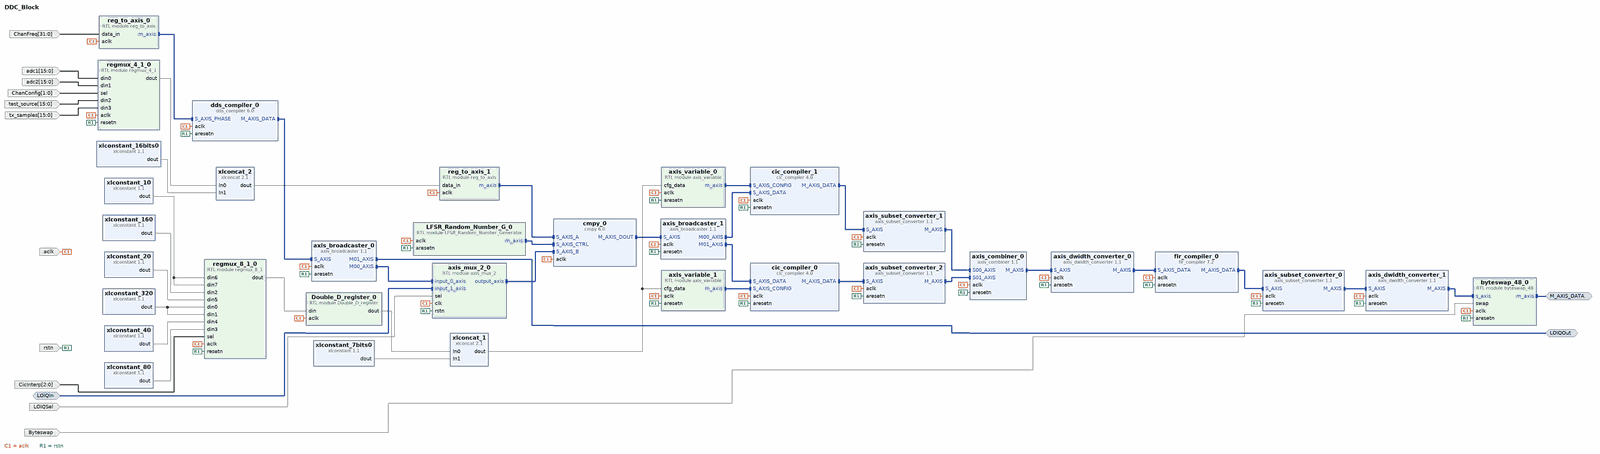
[diagram p0: block diagram of the top level, whole]
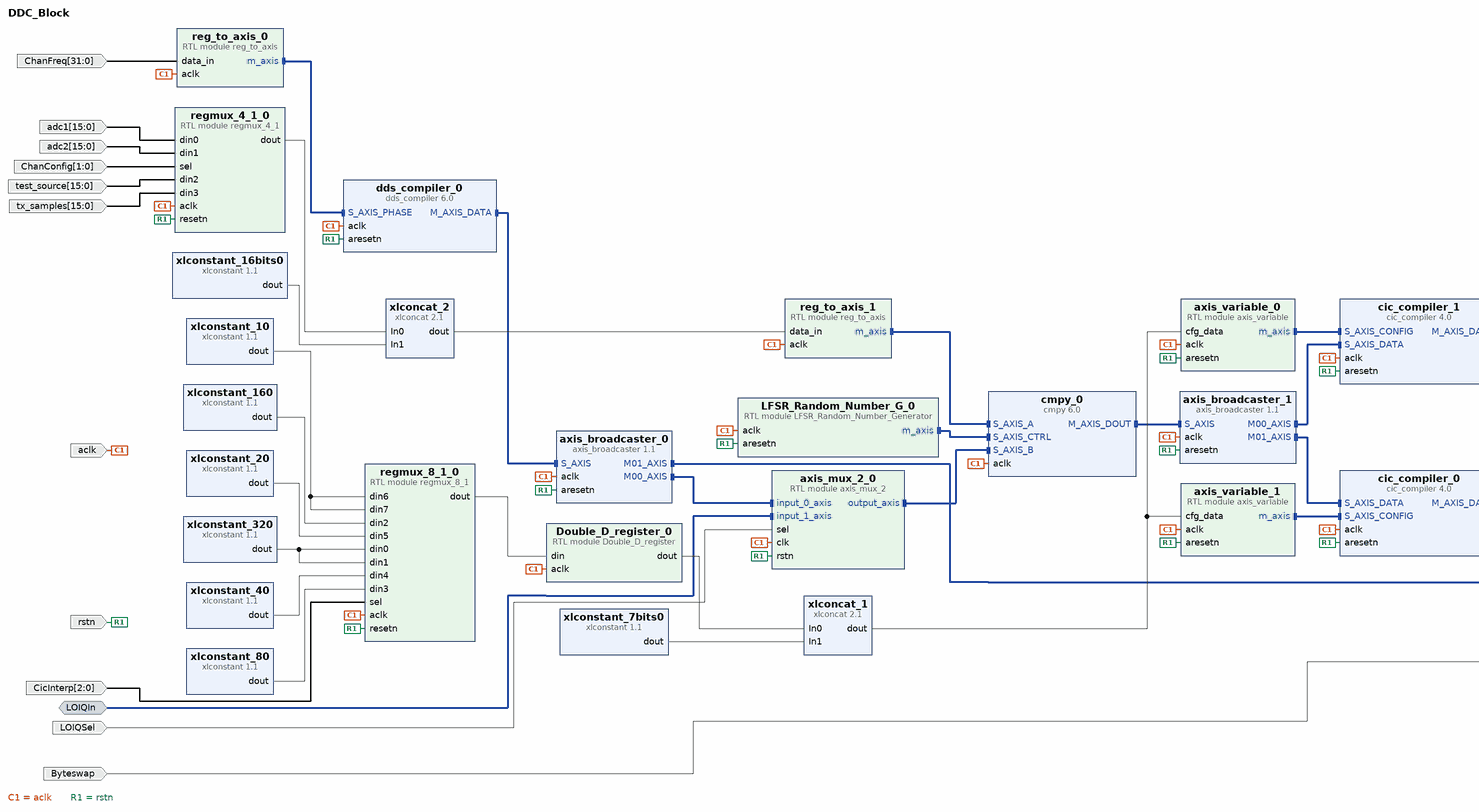
[diagram p1: block diagram of the top level, left part]
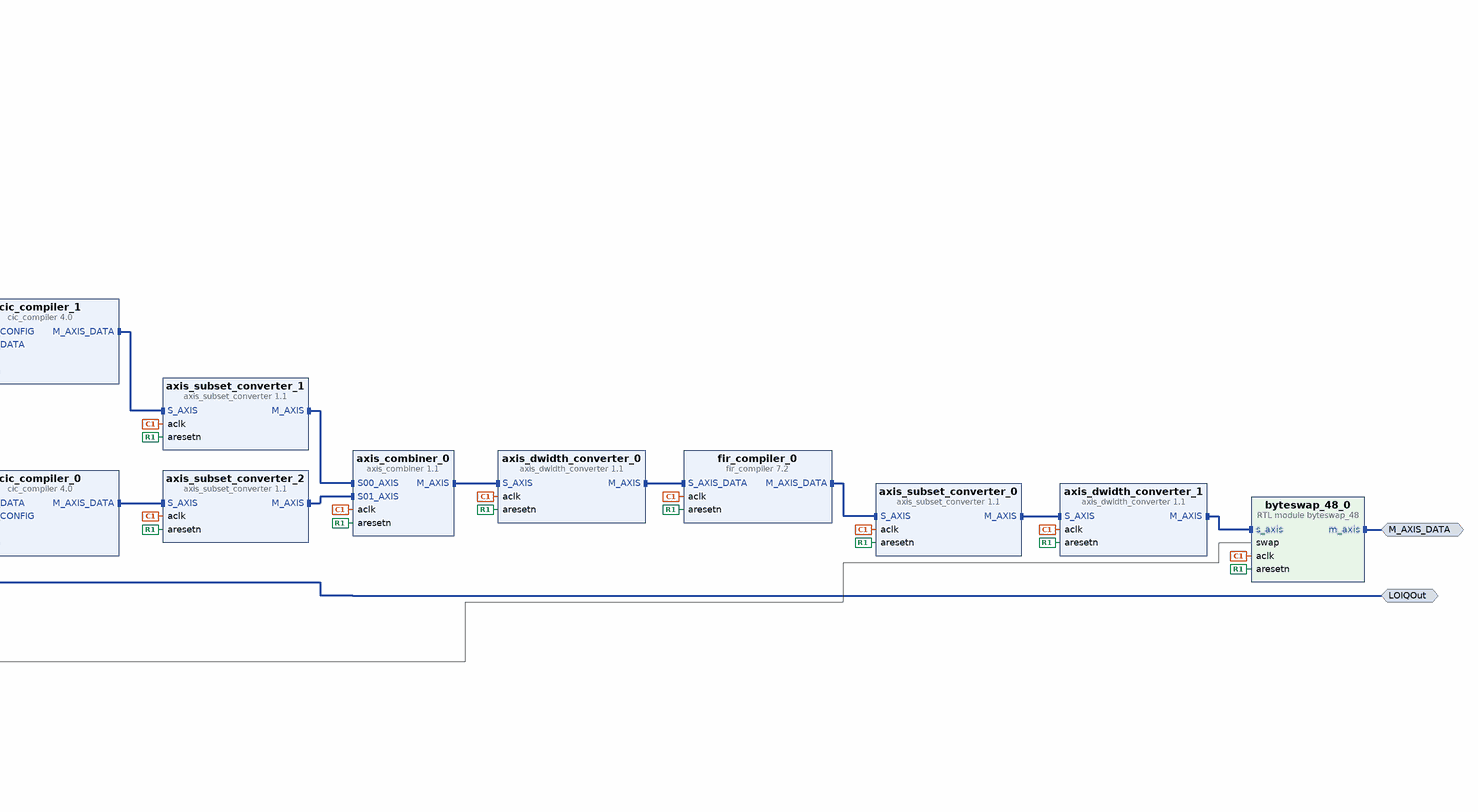
[diagram p2: block diagram of the top level, right part]
# Vivado block design DDC_Block, xc7a200tfbg676-2, Vivado 2023.1
create_bd_design DDC_Block

create_bd_intf_port -mode Master -vlnv xilinx.com:interface:axis_rtl:1.0 M_AXIS_DATA
set_property -dict {CONFIG.FREQ_HZ 122880000} [get_bd_intf_ports M_AXIS_DATA]
create_bd_intf_port -mode Master -vlnv xilinx.com:interface:axis_rtl:1.0 LOIQOut
set_property -dict {CONFIG.FREQ_HZ 122880000} [get_bd_intf_ports LOIQOut]
create_bd_intf_port -mode Slave -vlnv xilinx.com:interface:axis_rtl:1.0 LOIQIn
set_property -dict [list \
  CONFIG.FREQ_HZ 122880000 \
  CONFIG.HAS_TKEEP 0 \
  CONFIG.HAS_TLAST 0 \
  CONFIG.HAS_TREADY 1 \
  CONFIG.HAS_TSTRB 0 \
  CONFIG.LAYERED_METADATA undef \
  CONFIG.TDATA_NUM_BYTES 4 \
  CONFIG.TDEST_WIDTH 0 \
  CONFIG.TID_WIDTH 0 \
  CONFIG.TUSER_WIDTH 0 \
] [get_bd_intf_ports LOIQIn]
create_bd_port -dir I -from 1 -to 0 ChanConfig
create_bd_port -dir I -from 31 -to 0 ChanFreq
create_bd_port -dir I -from 2 -to 0 CicInterp
create_bd_port -dir I -type clk aclk
set_property -dict {CONFIG.FREQ_HZ 122880000} [get_bd_ports aclk]
create_bd_port -dir I -from 15 -to 0 adc1
create_bd_port -dir I -from 15 -to 0 adc2
create_bd_port -dir I -type rst rstn
create_bd_port -dir I -from 15 -to 0 test_source
create_bd_port -dir I -from 15 -to 0 tx_samples
create_bd_port -dir I LOIQSel
create_bd_port -dir I Byteswap

create_bd_cell -type ip -vlnv xilinx.com:ip:xlconcat:2.1 xlconcat_1
create_bd_cell -type ip -vlnv xilinx.com:ip:xlconcat:2.1 xlconcat_2
create_bd_cell -type module -reference Double_D_register Double_D_register_0
set_property -dict {CONFIG.DATA_WIDTH 9} [get_bd_cells Double_D_register_0]
create_bd_cell -type module -reference axis_variable axis_variable_0
set_property -dict {CONFIG.AXIS_TDATA_WIDTH 16} [get_bd_cells axis_variable_0]
create_bd_cell -type module -reference axis_variable axis_variable_1
set_property -dict {CONFIG.AXIS_TDATA_WIDTH 16} [get_bd_cells axis_variable_1]
create_bd_cell -type module -reference byteswap_48 byteswap_48_0
create_bd_cell -type ip -vlnv xilinx.com:ip:axis_broadcaster:1.1 axis_broadcaster_0
set_property -dict [list \
  CONFIG.M00_TDATA_REMAP {tdata[31:0]} \
  CONFIG.M01_TDATA_REMAP {tdata[31:0]} \
  CONFIG.M_TDATA_NUM_BYTES 4 \
  CONFIG.S_TDATA_NUM_BYTES 4 \
] [get_bd_cells axis_broadcaster_0]
create_bd_cell -type ip -vlnv xilinx.com:ip:axis_broadcaster:1.1 axis_broadcaster_1
set_property -dict [list \
  CONFIG.HAS_TREADY 0 \
  CONFIG.M00_TDATA_REMAP {tdata[23:0]} \
  CONFIG.M01_TDATA_REMAP {tdata[47:24]} \
  CONFIG.M_TDATA_NUM_BYTES 3 \
  CONFIG.S_TDATA_NUM_BYTES 6 \
] [get_bd_cells axis_broadcaster_1]
create_bd_cell -type ip -vlnv xilinx.com:ip:axis_combiner:1.1 axis_combiner_0
set_property -dict {CONFIG.NUM_SI 2} [get_bd_cells axis_combiner_0]
create_bd_cell -type ip -vlnv xilinx.com:ip:axis_dwidth_converter:1.1 axis_dwidth_converter_0
set_property -dict {CONFIG.M_TDATA_NUM_BYTES 4 CONFIG.S_TDATA_NUM_BYTES 8} [get_bd_cells axis_dwidth_converter_0]
create_bd_cell -type ip -vlnv xilinx.com:ip:axis_dwidth_converter:1.1 axis_dwidth_converter_1
set_property -dict [list \
  CONFIG.HAS_MI_TKEEP 0 \
  CONFIG.M_TDATA_NUM_BYTES 6 \
  CONFIG.S_TDATA_NUM_BYTES 3 \
] [get_bd_cells axis_dwidth_converter_1]
create_bd_cell -type ip -vlnv xilinx.com:ip:axis_subset_converter:1.1 axis_subset_converter_0
set_property -dict [list \
  CONFIG.M_TDATA_NUM_BYTES 3 \
  CONFIG.S_TDATA_NUM_BYTES 4 \
  CONFIG.TDATA_REMAP {tdata[23:0]} \
] [get_bd_cells axis_subset_converter_0]
create_bd_cell -type ip -vlnv xilinx.com:ip:axis_subset_converter:1.1 axis_subset_converter_1
set_property -dict [list \
  CONFIG.M_TDATA_NUM_BYTES 4 \
  CONFIG.S_TDATA_NUM_BYTES 4 \
  CONFIG.TDATA_REMAP {tdata[29],tdata[29], tdata[29], tdata[29], tdata[29], tdata[29], tdata[29], tdata[29:5]} \
] [get_bd_cells axis_subset_converter_1]
create_bd_cell -type ip -vlnv xilinx.com:ip:axis_subset_converter:1.1 axis_subset_converter_2
set_property -dict [list \
  CONFIG.M_TDATA_NUM_BYTES 4 \
  CONFIG.S_TDATA_NUM_BYTES 4 \
  CONFIG.TDATA_REMAP {tdata[29],tdata[29], tdata[29], tdata[29], tdata[29], tdata[29], tdata[29], tdata[29:5]} \
] [get_bd_cells axis_subset_converter_2]
create_bd_cell -type ip -vlnv xilinx.com:ip:cic_compiler:4.0 cic_compiler_0
set_property -dict [list \
  CONFIG.Clock_Frequency 122.88 \
  CONFIG.Filter_Type Decimation \
  CONFIG.Fixed_Or_Initial_Rate 40 \
  CONFIG.HAS_ARESETN true \
  CONFIG.Input_Data_Width 24 \
  CONFIG.Input_Sample_Frequency 122.88 \
  CONFIG.Maximum_Rate 320 \
  CONFIG.Minimum_Rate 10 \
  CONFIG.Number_Of_Stages 6 \
  CONFIG.Output_Data_Width 32 \
  CONFIG.Quantization Truncation \
  CONFIG.RateSpecification Frequency_Specification \
  CONFIG.SamplePeriod 1 \
  CONFIG.Sample_Rate_Changes Programmable \
  CONFIG.Use_Xtreme_DSP_Slice false \
] [get_bd_cells cic_compiler_0]
create_bd_cell -type ip -vlnv xilinx.com:ip:cic_compiler:4.0 cic_compiler_1
set_property -dict [list \
  CONFIG.Clock_Frequency 122.88 \
  CONFIG.Filter_Type Decimation \
  CONFIG.Fixed_Or_Initial_Rate 40 \
  CONFIG.HAS_ARESETN true \
  CONFIG.Input_Data_Width 24 \
  CONFIG.Input_Sample_Frequency 122.88 \
  CONFIG.Maximum_Rate 320 \
  CONFIG.Minimum_Rate 10 \
  CONFIG.Number_Of_Stages 6 \
  CONFIG.Output_Data_Width 32 \
  CONFIG.Quantization Truncation \
  CONFIG.RateSpecification Frequency_Specification \
  CONFIG.SamplePeriod 1 \
  CONFIG.Sample_Rate_Changes Programmable \
  CONFIG.Use_Xtreme_DSP_Slice false \
] [get_bd_cells cic_compiler_1]
create_bd_cell -type ip -vlnv xilinx.com:ip:cmpy:6.0 cmpy_0
set_property -dict [list \
  CONFIG.MinimumLatency 6 \
  CONFIG.OptimizeGoal Resources \
  CONFIG.OutputWidth 24 \
  CONFIG.RoundMode Random_Rounding \
] [get_bd_cells cmpy_0]
create_bd_cell -type ip -vlnv xilinx.com:ip:dds_compiler:6.0 dds_compiler_0
set_property -dict [list \
  CONFIG.Amplitude_Mode Full_Range \
  CONFIG.DATA_Has_TLAST Not_Required \
  CONFIG.DDS_Clock_Rate 122.88 \
  CONFIG.Frequency_Resolution 0.05 \
  CONFIG.Has_ARESETn true \
  CONFIG.Has_Phase_Out false \
  CONFIG.Latency 8 \
  CONFIG.M_DATA_Has_TUSER Not_Required \
  CONFIG.Noise_Shaping Auto \
  CONFIG.Output_Frequency1 0 \
  CONFIG.Output_Width 16 \
  CONFIG.PINC1 0 \
  CONFIG.Parameter_Entry System_Parameters \
  CONFIG.Phase_Increment Streaming \
  CONFIG.Phase_Width 32 \
  CONFIG.S_PHASE_Has_TUSER Not_Required \
  CONFIG.Spurious_Free_Dynamic_Range 95 \
] [get_bd_cells dds_compiler_0]
create_bd_cell -type ip -vlnv xilinx.com:ip:fir_compiler:7.2 fir_compiler_0
set_property -dict [list \
  CONFIG.Clock_Frequency 122.88 \
  CONFIG.CoefficientSource COE_File \
  CONFIG.CoefficientVector 6,0,-4,-3,5,6,-6,-13,7,44,64,44,7,-13,-6,6,5,-3,-4,0,6 \
  CONFIG.Coefficient_Fanout true \
  CONFIG.Coefficient_File ../../../../../../../sources/coefficientfiles/tx1024cfirImpulse.coe \
  CONFIG.Coefficient_Fractional_Bits 20 \
  CONFIG.Coefficient_Sets 1 \
  CONFIG.Coefficient_Sign Signed \
  CONFIG.Coefficient_Structure Inferred \
  CONFIG.Coefficient_Width 18 \
  CONFIG.ColumnConfig 13 \
  CONFIG.Control_Broadcast_Fanout true \
  CONFIG.Control_Column_Fanout true \
  CONFIG.Control_LUT_Pipeline true \
  CONFIG.Control_Path_Fanout true \
  CONFIG.DATA_Has_TLAST Not_Required \
  CONFIG.Data_Fractional_Bits 0 \
  CONFIG.Data_Path_Broadcast false \
  CONFIG.Data_Path_Fanout true \
  CONFIG.Data_Width 25 \
  CONFIG.Decimation_Rate 8 \
  CONFIG.Disable_Half_Band_Centre_Tap false \
  CONFIG.Filter_Architecture Systolic_Multiply_Accumulate \
  CONFIG.Filter_Type Decimation \
  CONFIG.Has_ARESETn true \
  CONFIG.Interpolation_Rate 1 \
  CONFIG.M_DATA_Has_TREADY true \
  CONFIG.M_DATA_Has_TUSER Not_Required \
  CONFIG.No_BRAM_Read_First_Mode true \
  CONFIG.No_SRL_Attributes false \
  CONFIG.Number_Channels 2 \
  CONFIG.Optimal_Column_Lengths true \
  CONFIG.Optimization_Goal Speed \
  CONFIG.Optimization_List Data_Path_Fanout,Pre-Adder_Pipeline,Coefficient_Fanout,Control_Path_Fanout,Control_Column_Fanout,Control_Broadcast_Fanout,Control_LUT_Pipeline,No_BRAM_Read_First_Mode,Optimal_Column_Lengths,Other \
  CONFIG.Optimization_Selection All \
  CONFIG.Other true \
  CONFIG.Output_Rounding_Mode Non_Symmetric_Rounding_Up \
  CONFIG.Output_Width 27 \
  CONFIG.Pre_Adder_Pipeline true \
  CONFIG.Quantization Quantize_Only \
  CONFIG.RateSpecification Frequency_Specification \
  CONFIG.S_DATA_Has_TUSER Not_Required \
  CONFIG.Sample_Frequency 12.288 \
  CONFIG.Select_Pattern All \
  CONFIG.Zero_Pack_Factor 1 \
] [get_bd_cells fir_compiler_0]
create_bd_cell -type ip -vlnv xilinx.com:ip:xlconstant:1.1 xlconstant_10
set_property -dict {CONFIG.CONST_VAL 10 CONFIG.CONST_WIDTH 9} [get_bd_cells xlconstant_10]
create_bd_cell -type ip -vlnv xilinx.com:ip:xlconstant:1.1 xlconstant_160
set_property -dict {CONFIG.CONST_VAL 160 CONFIG.CONST_WIDTH 9} [get_bd_cells xlconstant_160]
create_bd_cell -type ip -vlnv xilinx.com:ip:xlconstant:1.1 xlconstant_16bits0
set_property -dict {CONFIG.CONST_VAL 0 CONFIG.CONST_WIDTH 16} [get_bd_cells xlconstant_16bits0]
create_bd_cell -type ip -vlnv xilinx.com:ip:xlconstant:1.1 xlconstant_20
set_property -dict {CONFIG.CONST_VAL 20 CONFIG.CONST_WIDTH 9} [get_bd_cells xlconstant_20]
create_bd_cell -type ip -vlnv xilinx.com:ip:xlconstant:1.1 xlconstant_320
set_property -dict {CONFIG.CONST_VAL 320 CONFIG.CONST_WIDTH 9} [get_bd_cells xlconstant_320]
create_bd_cell -type ip -vlnv xilinx.com:ip:xlconstant:1.1 xlconstant_40
set_property -dict {CONFIG.CONST_VAL 40 CONFIG.CONST_WIDTH 9} [get_bd_cells xlconstant_40]
create_bd_cell -type ip -vlnv xilinx.com:ip:xlconstant:1.1 xlconstant_7bits0
set_property -dict {CONFIG.CONST_VAL 0 CONFIG.CONST_WIDTH 7} [get_bd_cells xlconstant_7bits0]
create_bd_cell -type ip -vlnv xilinx.com:ip:xlconstant:1.1 xlconstant_80
set_property -dict {CONFIG.CONST_VAL 80 CONFIG.CONST_WIDTH 9} [get_bd_cells xlconstant_80]
create_bd_cell -type module -reference reg_to_axis reg_to_axis_0
set_property -dict {CONFIG.DIN_WIDTH 32} [get_bd_cells reg_to_axis_0]
create_bd_cell -type module -reference reg_to_axis reg_to_axis_1
set_property -dict {CONFIG.DIN_WIDTH 32} [get_bd_cells reg_to_axis_1]
create_bd_cell -type module -reference axis_mux_2 axis_mux_2_0
set_property -dict [list \
  CONFIG.CONSUME_ALL 1 \
  CONFIG.DATA_WIDTH 32 \
  CONFIG.DEST_WIDTH 0 \
  CONFIG.KEEP_ENABLE false \
] [get_bd_cells axis_mux_2_0]
create_bd_cell -type module -reference LFSR_Random_Number_Generator LFSR_Random_Number_G_0
create_bd_cell -type module -reference regmux_4_1 regmux_4_1_0
create_bd_cell -type module -reference regmux_8_1 regmux_8_1_0
set_property -dict {CONFIG.DATA_WIDTH 9} [get_bd_cells regmux_8_1_0]

# ---- connections ----

connect_bd_intf_net [get_bd_intf_pins LFSR_Random_Number_G_0/m_axis] [get_bd_intf_pins cmpy_0/S_AXIS_CTRL]
connect_bd_intf_net [get_bd_intf_ports LOIQIn] [get_bd_intf_pins axis_mux_2_0/input_1_axis]
connect_bd_intf_net [get_bd_intf_pins axis_broadcaster_0/M00_AXIS] [get_bd_intf_pins axis_mux_2_0/input_0_axis]
connect_bd_intf_net [get_bd_intf_ports LOIQOut] [get_bd_intf_pins axis_broadcaster_0/M01_AXIS]
connect_bd_intf_net [get_bd_intf_pins axis_broadcaster_1/M00_AXIS] [get_bd_intf_pins cic_compiler_1/S_AXIS_DATA]
connect_bd_intf_net [get_bd_intf_pins axis_broadcaster_1/M01_AXIS] [get_bd_intf_pins cic_compiler_0/S_AXIS_DATA]
connect_bd_intf_net [get_bd_intf_pins axis_combiner_0/M_AXIS] [get_bd_intf_pins axis_dwidth_converter_0/S_AXIS]
connect_bd_intf_net [get_bd_intf_pins axis_dwidth_converter_0/M_AXIS] [get_bd_intf_pins fir_compiler_0/S_AXIS_DATA]
connect_bd_intf_net [get_bd_intf_pins axis_dwidth_converter_1/M_AXIS] [get_bd_intf_pins byteswap_48_0/s_axis]
connect_bd_intf_net [get_bd_intf_pins axis_mux_2_0/output_axis] [get_bd_intf_pins cmpy_0/S_AXIS_B]
connect_bd_intf_net [get_bd_intf_pins axis_subset_converter_0/M_AXIS] [get_bd_intf_pins axis_dwidth_converter_1/S_AXIS]
connect_bd_intf_net [get_bd_intf_pins axis_subset_converter_1/M_AXIS] [get_bd_intf_pins axis_combiner_0/S00_AXIS]
connect_bd_intf_net [get_bd_intf_pins axis_subset_converter_2/M_AXIS] [get_bd_intf_pins axis_combiner_0/S01_AXIS]
connect_bd_intf_net [get_bd_intf_pins axis_variable_0/m_axis] [get_bd_intf_pins cic_compiler_1/S_AXIS_CONFIG]
connect_bd_intf_net [get_bd_intf_pins axis_variable_1/m_axis] [get_bd_intf_pins cic_compiler_0/S_AXIS_CONFIG]
connect_bd_intf_net [get_bd_intf_ports M_AXIS_DATA] [get_bd_intf_pins byteswap_48_0/m_axis]
connect_bd_intf_net [get_bd_intf_pins cic_compiler_0/M_AXIS_DATA] [get_bd_intf_pins axis_subset_converter_2/S_AXIS]
connect_bd_intf_net [get_bd_intf_pins cic_compiler_1/M_AXIS_DATA] [get_bd_intf_pins axis_subset_converter_1/S_AXIS]
connect_bd_intf_net [get_bd_intf_pins cmpy_0/M_AXIS_DOUT] [get_bd_intf_pins axis_broadcaster_1/S_AXIS]
connect_bd_intf_net [get_bd_intf_pins dds_compiler_0/M_AXIS_DATA] [get_bd_intf_pins axis_broadcaster_0/S_AXIS]
connect_bd_intf_net [get_bd_intf_pins fir_compiler_0/M_AXIS_DATA] [get_bd_intf_pins axis_subset_converter_0/S_AXIS]
connect_bd_intf_net [get_bd_intf_pins dds_compiler_0/S_AXIS_PHASE] [get_bd_intf_pins reg_to_axis_0/m_axis]
connect_bd_intf_net [get_bd_intf_pins cmpy_0/S_AXIS_A] [get_bd_intf_pins reg_to_axis_1/m_axis]
connect_bd_net [get_bd_ports Byteswap] [get_bd_pins byteswap_48_0/swap]
connect_bd_net [get_bd_ports ChanFreq] [get_bd_pins reg_to_axis_0/data_in]
connect_bd_net [get_bd_ports CicInterp] [get_bd_pins regmux_8_1_0/sel]
connect_bd_net [get_bd_pins Double_D_register_0/dout] [get_bd_pins xlconcat_1/In0]
connect_bd_net [get_bd_ports LOIQSel] [get_bd_pins axis_mux_2_0/sel]
connect_bd_net [get_bd_ports aclk] \
  [get_bd_pins Double_D_register_0/aclk] [get_bd_pins axis_variable_0/aclk] [get_bd_pins axis_variable_1/aclk] \
  [get_bd_pins byteswap_48_0/aclk] [get_bd_pins axis_broadcaster_0/aclk] [get_bd_pins axis_broadcaster_1/aclk] \
  [get_bd_pins axis_combiner_0/aclk] [get_bd_pins axis_dwidth_converter_0/aclk] [get_bd_pins axis_dwidth_converter_1/aclk] \
  [get_bd_pins axis_subset_converter_0/aclk] [get_bd_pins axis_subset_converter_1/aclk] \
  [get_bd_pins axis_subset_converter_2/aclk] [get_bd_pins cic_compiler_0/aclk] [get_bd_pins cic_compiler_1/aclk] \
  [get_bd_pins cmpy_0/aclk] [get_bd_pins dds_compiler_0/aclk] [get_bd_pins fir_compiler_0/aclk] \
  [get_bd_pins reg_to_axis_0/aclk] [get_bd_pins reg_to_axis_1/aclk] [get_bd_pins axis_mux_2_0/clk] \
  [get_bd_pins LFSR_Random_Number_G_0/aclk] [get_bd_pins regmux_4_1_0/aclk] [get_bd_pins regmux_8_1_0/aclk]
connect_bd_net -net adc1_1 [get_bd_ports adc1] [get_bd_pins regmux_4_1_0/din0]
connect_bd_net -net adc2_1 [get_bd_ports adc2] [get_bd_pins regmux_4_1_0/din1]
connect_bd_net [get_bd_pins regmux_4_1_0/dout] [get_bd_pins xlconcat_2/In0]
connect_bd_net [get_bd_pins regmux_8_1_0/dout] [get_bd_pins Double_D_register_0/din]
connect_bd_net [get_bd_ports rstn] \
  [get_bd_pins axis_variable_0/aresetn] [get_bd_pins axis_variable_1/aresetn] [get_bd_pins byteswap_48_0/aresetn] \
  [get_bd_pins axis_broadcaster_0/aresetn] [get_bd_pins axis_broadcaster_1/aresetn] [get_bd_pins axis_combiner_0/aresetn] \
  [get_bd_pins axis_dwidth_converter_0/aresetn] [get_bd_pins axis_dwidth_converter_1/aresetn] \
  [get_bd_pins axis_subset_converter_0/aresetn] [get_bd_pins axis_subset_converter_1/aresetn] \
  [get_bd_pins axis_subset_converter_2/aresetn] [get_bd_pins cic_compiler_0/aresetn] [get_bd_pins cic_compiler_1/aresetn] \
  [get_bd_pins dds_compiler_0/aresetn] [get_bd_pins fir_compiler_0/aresetn] [get_bd_pins axis_mux_2_0/rstn] \
  [get_bd_pins LFSR_Random_Number_G_0/aresetn] [get_bd_pins regmux_4_1_0/resetn] [get_bd_pins regmux_8_1_0/resetn]
connect_bd_net -net sel_0_1 [get_bd_ports ChanConfig] [get_bd_pins regmux_4_1_0/sel]
connect_bd_net [get_bd_ports test_source] [get_bd_pins regmux_4_1_0/din2]
connect_bd_net [get_bd_ports tx_samples] [get_bd_pins regmux_4_1_0/din3]
connect_bd_net [get_bd_pins xlconcat_1/dout] [get_bd_pins axis_variable_0/cfg_data] [get_bd_pins axis_variable_1/cfg_data]
connect_bd_net [get_bd_pins xlconcat_2/dout] [get_bd_pins reg_to_axis_1/data_in]
connect_bd_net [get_bd_pins xlconstant_10/dout] [get_bd_pins regmux_8_1_0/din6] [get_bd_pins regmux_8_1_0/din7]
connect_bd_net [get_bd_pins xlconstant_160/dout] [get_bd_pins regmux_8_1_0/din2]
connect_bd_net [get_bd_pins xlconstant_16bits0/dout] [get_bd_pins xlconcat_2/In1]
connect_bd_net [get_bd_pins xlconstant_20/dout] [get_bd_pins regmux_8_1_0/din5]
connect_bd_net [get_bd_pins xlconstant_320/dout] [get_bd_pins regmux_8_1_0/din0] [get_bd_pins regmux_8_1_0/din1]
connect_bd_net [get_bd_pins xlconstant_40/dout] [get_bd_pins regmux_8_1_0/din4]
connect_bd_net [get_bd_pins xlconstant_7bits0/dout] [get_bd_pins xlconcat_1/In1]
connect_bd_net [get_bd_pins xlconstant_80/dout] [get_bd_pins regmux_8_1_0/din3]

validate_bd_design
save_bd_design
